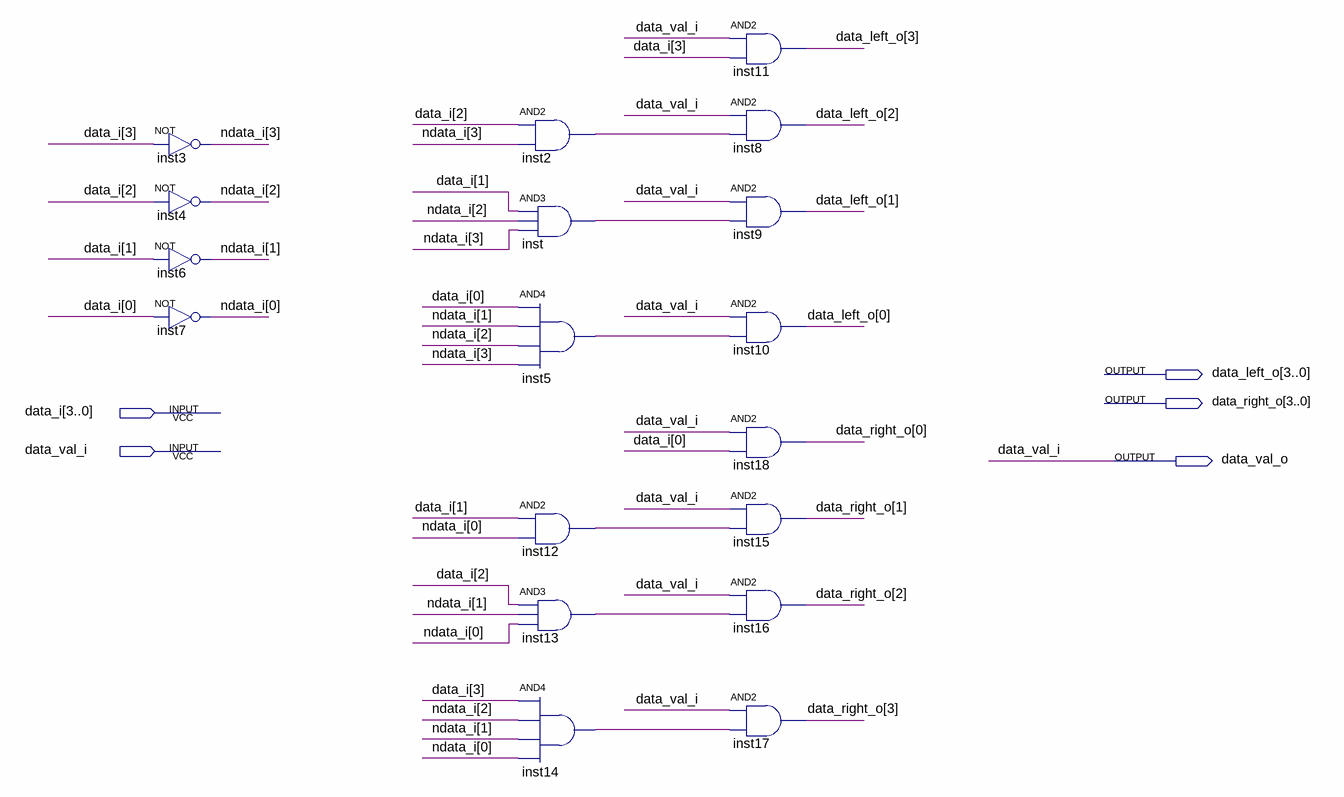
[diagram p0: schematic sheet]
// Quartus schematic priority_encoder_4.bdf as structural Verilog: 18 symbols, 5 pins
module priority_encoder_4 (
  input  [3:0] data_i,
  input  data_val_i,
  output [3:0] data_left_o,
  output [3:0] data_right_o,
  output data_val_o
);

  wire inst2_out, inst5_out, inst12_out, inst13_out, inst14_out, inst_out;
  wire [3:0] ndata_i;

  not inst3 (ndata_i[3], data_i[3]);
  not inst4 (ndata_i[2], data_i[2]);
  not inst6 (ndata_i[1], data_i[1]);
  not inst7 (ndata_i[0], data_i[0]);
  and inst2 (inst2_out, data_i[2], ndata_i[3]);
  and inst (inst_out, data_i[1], ndata_i[2], ndata_i[3]);
  and inst5 (inst5_out, data_i[0], ndata_i[1], ndata_i[2], ndata_i[3]);
  and inst12 (inst12_out, data_i[1], ndata_i[0]);
  and inst13 (inst13_out, data_i[2], ndata_i[1], ndata_i[0]);
  and inst14 (inst14_out, data_i[3], ndata_i[2], ndata_i[1], ndata_i[0]);
  and inst11 (data_left_o[3], data_val_i, data_i[3]);
  and inst8 (data_left_o[2], data_val_i, inst2_out);
  and inst9 (data_left_o[1], data_val_i, inst_out);
  and inst10 (data_left_o[0], data_val_i, inst5_out);
  and inst18 (data_right_o[0], data_val_i, data_i[0]);
  and inst15 (data_right_o[1], data_val_i, inst12_out);
  and inst16 (data_right_o[2], data_val_i, inst13_out);
  and inst17 (data_right_o[3], data_val_i, inst14_out);

  assign data_val_o = data_val_i;
endmodule
